# Altium schematic sheet 驱动.SchDoc
size A4
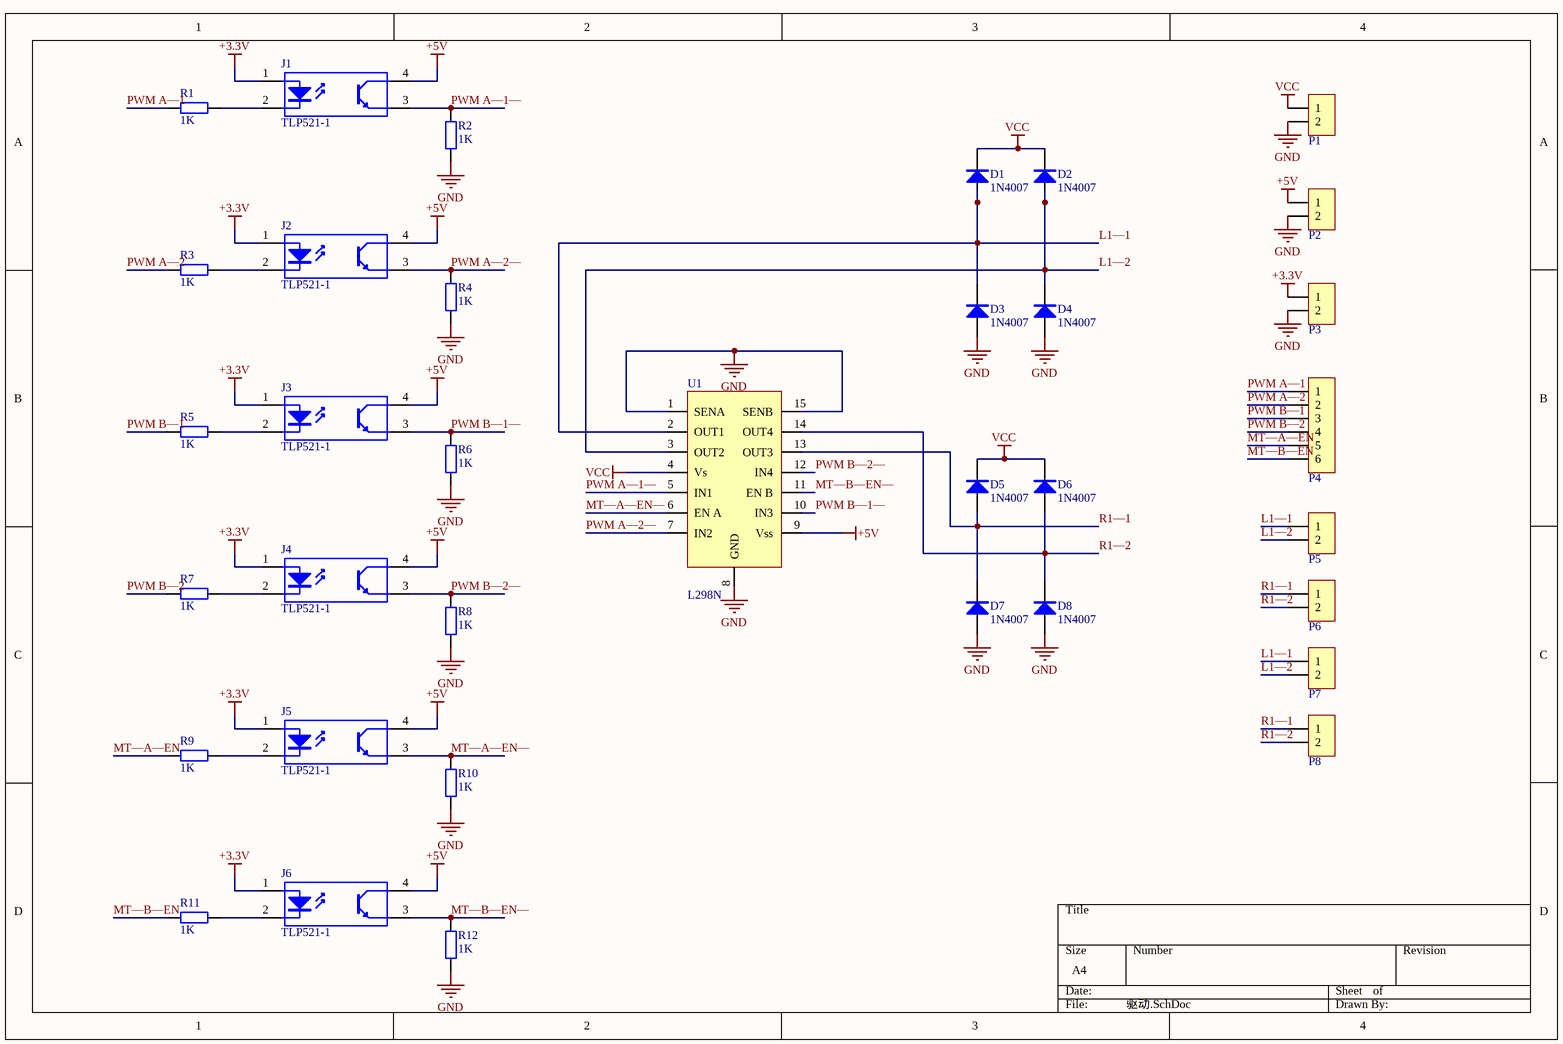
[diagram p0: 驱动.SchDoc]

## Parts
D1  1N4007  [SOD-123]
D2  1N4007  [SOD-123]
D3  1N4007  [SOD-123]
D4  1N4007  [SOD-123]
D5  1N4007  [SOD-123]
D6  1N4007  [SOD-123]
D7  1N4007  [SOD-123]
D8  1N4007  [SOD-123]
J1  TLP521-1  [DIP4-300]
J2  TLP521-1  [DIP4-300]
J3  TLP521-1  [DIP4-300]
J4  TLP521-1  [DIP4-300]
J5  TLP521-1  [DIP4-300]
J6  TLP521-1  [DIP4-300]
P1  HDR-1X2  [KF128-3.81-2P]  (value not drawn)
P2  HDR-1X2  [HDR1X2]  (value not drawn)
P3  HDR-1X2  [HDR1X2]  (value not drawn)
P4  HDR-1X6  [HDR1X6]  (value not drawn)
P5  HDR-1X2  [KF128-3.81-2P]  (value not drawn)
P6  HDR-1X2  [KF128-3.81-2P]  (value not drawn)
P7  HDR-1X2  [KF128-3.81-2P]  (value not drawn)
P8  HDR-1X2  [KF128-3.81-2P]  (value not drawn)
R1  1K  [R 0805_L]
R2  1K  [R 0805_L]
R3  1K  [R 0805_L]
R4  1K  [R 0805_L]
R5  1K  [R 0805_L]
R6  1K  [R 0805_L]
R7  1K  [R 0805_L]
R8  1K  [R 0805_L]
R9  1K  [R 0805_L]
R10  1K  [R 0805_L]
R11  1K  [R 0805_L]
R12  1K  [R 0805_L]
U1  L298N  [Multiwatt15-V]

## Nets
+3.3V: J1.1(A) J2.1(A) J3.1(A) J4.1(A) J5.1(A) J6.1(A) P3.1
+5V: J1.4(C) J2.4(C) J3.4(C) J4.4(C) J5.4(C) J6.4(C) P2.1 U1.9(Vss)
GND: D3.1(A) D4.1(A) D7.1(A) D8.1(A) P1.2 P2.2 P3.2 R2.1 R4.1 R6.1 R8.1 R10.1 R12.1 U1.1(SENA) U1.8(GND) U1.15(SENB)
VCC: D1.2(K) D2.2(K) D5.2(K) D6.2(K) P1.1 U1.4(Vs)
L1—1: D1.1(A) D3.2(K) P5.1 P7.1 U1.2(OUT1)
L1—2: D2.1(A) D4.2(K) P5.2 P7.2 U1.3(OUT2)
MT—A—EN: P4.5 R9.1
MT—A—EN—: J5.3(E) R10.2 U1.6(EN_A)
MT—B—EN: P4.6 R11.1
MT—B—EN—: J6.3(E) R12.2 U1.11(EN_B)
PWM A—1: P4.1 R1.1
PWM A—1—: J1.3(E) R2.2 U1.5(IN1)
PWM A—2: P4.2 R3.1
PWM A—2—: J2.3(E) R4.2 U1.7(IN2)
PWM B—1: P4.3 R5.1
PWM B—1—: J3.3(E) R6.2 U1.10(IN3)
PWM B—2: P4.4 R7.1
PWM B—2—: J4.3(E) R8.2 U1.12(IN4)
R1—1: D5.1(A) D7.2(K) P6.1 P8.1 U1.13(OUT3)
R1—2: D6.1(A) D8.2(K) P6.2 P8.2 U1.14(OUT4)
NetJ1_2: J1.2(K) R1.2
NetJ2_2: J2.2(K) R3.2
NetJ3_2: J3.2(K) R5.2
NetJ4_2: J4.2(K) R7.2
NetJ5_2: J5.2(K) R9.2
NetJ6_2: J6.2(K) R11.2

## Library data of the parts
D1-D8 = 1N4007: 整流二极管; 淘宝ID: 封装库来自淘宝 ID：黄晶宝石; 封装库来自淘宝卖家 ID：黄晶宝石: 其他店铺购入均为盗版，不享受售后技术支持服务，请立即申请退款; BOM名称: 整流二极管; 联系售后，技术支持: https://shop463601444.taobao.com
J1-J6 = TLP521-1: 1路开关光耦; 版权归属: 封装库来自淘宝 ID：黄晶宝石; BOM名称: 1路开关光耦; 学习资源: https://shop463601444.taobao.com
P1-P3 P5-P8 = Header 2: 2P接插件; 版权归属: 封装库来自淘宝 ID：黄晶宝石; BOM名称: 2P接插件; 技术支持，联系售后: https://shop463601444.taobao.com
P4 = Header 6: 6P接插件; 版权归属: 封装库来自淘宝 ID：黄晶宝石; BOM名称: 6P接插件; 学习资源: https://shop463601444.taobao.com
R1-R12 = R: 贴片电阻; 版权归属: 来自淘宝 ID：黄晶宝石; 封装库来自淘宝卖家 ID：黄晶宝石: 其他店铺购入均为盗版，不享受售后技术支持服务，请立即申请退款; BOM名称: 贴片电阻; 联系售后: https://shop463601444.taobao.com